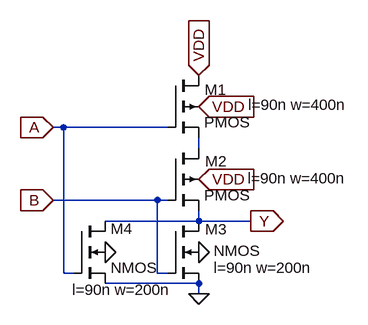
[diagram p0: schematic nor.asc]
nor.asc, the LTspice schematic file:
Version 4
SHEET 1 880 680
WIRE 16 -176 0 -176
WIRE 176 -176 16 -176
WIRE 224 -144 224 -160
WIRE 160 -64 0 -64
WIRE 176 -64 160 -64
WIRE 224 -32 224 -48
WIRE 224 -32 80 -32
WIRE 304 -32 224 -32
WIRE 16 48 16 -176
WIRE 32 48 16 48
WIRE 160 48 160 -64
WIRE 176 48 160 48
WIRE 224 64 80 64
WIRE 224 80 224 64
FLAG 0 -176 A
IOPIN 0 -176 In
FLAG 0 -64 B
IOPIN 0 -64 In
FLAG 224 -256 VDD
IOPIN 224 -256 In
FLAG 304 -32 Y
IOPIN 304 -32 Out
FLAG 224 -208 VDD
IOPIN 224 -208 In
FLAG 224 -96 VDD
IOPIN 224 -96 In
FLAG 224 16 0
FLAG 80 16 0
FLAG 224 80 0
SYMBOL pmos4 176 -256 R0
WINDOW 123 124 45 Left 2
WINDOW 0 57 22 Left 2
SYMATTR Value2 l=90n w=400n
SYMATTR InstName M1
SYMBOL pmos4 176 -144 R0
WINDOW 123 123 46 Left 2
WINDOW 0 58 20 Left 2
SYMATTR Value2 l=90n w=400n
SYMATTR InstName M2
SYMBOL nmos4 176 -32 R0
WINDOW 123 71 72 Left 2
WINDOW 0 58 13 Left 2
WINDOW 3 71 46 Left 2
SYMATTR Value2 l=90n w=200n
SYMATTR InstName M3
SYMBOL nmos4 32 -32 R0
WINDOW 123 -3 106 Left 2
WINDOW 0 56 12 Left 2
SYMATTR Value2 l=90n w=200n
SYMATTR InstName M4

The netlist it stands for:
* nor.asc
M1 VDD A N001 VDD PMOS l=90n w=400n
M2 N001 B Y VDD PMOS l=90n w=400n
M3 Y B 0 0 NMOS l=90n w=200n
M4 Y A 0 0 NMOS l=90n w=200n
.model NMOS NMOS
.model PMOS PMOS
.lib standard.mos
.backanno
.end